# Altium project VlakecDuplo.PrjPCB
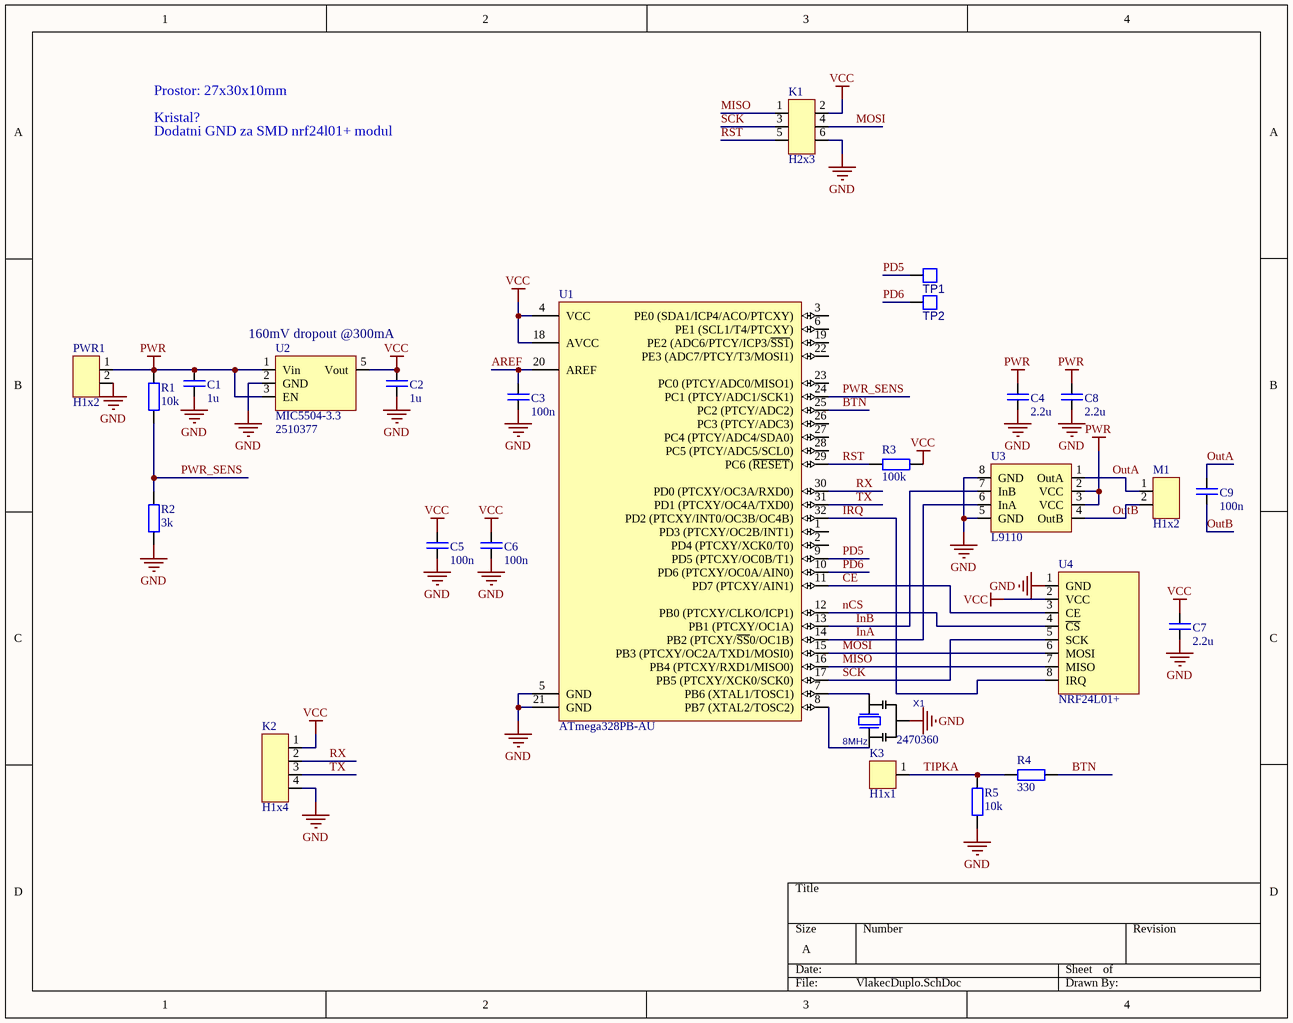
[diagram p0: VlakecDuplo.SchDoc]
1 sheet, 26 parts. Net scope: global (net labels, ports and power ports of the same name join across sheets).
Board file: VlakecDuplo.PcbDoc

## Sheet VlakecDuplo.SchDoc
size A

### Parts
C1  1u  [C0805(2012)_N]
C2  1u  [C0805(2012)_N]
C3  100n  [C0805(2012)_N]
C4  2.2u  [C0805(2012)_N]
C5  100n  [C0805(2012)_N]
C6  100n  [C0805(2012)_N]
C7  2.2u  [C0805(2012)_N]
C8  2.2u  [C0805(2012)_N]
C9  100n  [C0805(2012)_N]
K1  H2x3  [H2X3_SPEEDY]
K2  H1x4  [H1x4]
K3  H1x1  [H1x1]
M1  H1x2  [H1x2]
PWR1  H1x2  [H1x2]
R1  10k  [R0805(2012)_N]
R2  3k  [R0805(2012)_N]
R3  100k  [R0805(2012)_N]
R4  330  [R0805(2012)_N]
R5  10k  [R0805(2012)_N]
TP1  PD5  [PAD_HOLE]  (value not drawn)
TP2  PD6  [PAD_HOLE]  (value not drawn)
U1  ATmega328PB-AU  [32A_N]
U2  MIC5504-3.3  Supplier Part Number 1: 2510377  [SOT23-5]
U3  L9110  [SOP-8]
U4  NRF24L01+  [NRF24L01+smd_module]
X1  8MHz  Supplier Part Number 1: 2470360  [RESONATOR_3213met_L]

### Nets
GND: C1.2 C2.2 C3.2 C4.2 C5.2 C6.2 C7.2 C8.2 K1.6 K2.4 PWR1.2 R2.2 R5.2 U1.5(GND) U1.21(GND) U2.2(GND) U3.5(GND) U3.8(GND) U4.1(GND) X1.2(GND)
PWR: C1.1 C4.1 C8.1 PWR1.1 R1.1 U2.1(Vin) U2.3(EN) U3.2(VCC) U3.3(VCC)
VCC: C2.1 C5.1 C6.1 C7.1 K1.2 K2.1 R3.2 U1.4(VCC) U1.18(AVCC) U2.5(Vout) U4.2(VCC)
AREF: C3.1 U1.20(AREF)
BTN: R4.2 U1.25(PC2_(PTCY/ADC2))
CE: U1.11(PD7_(PTCXY/AIN1)) U4.3(CE)
InA: U1.14(PB2_(PTCXY/~{SS}0/OC1B)) U3.6(InA)
InB: U1.13(PB1_(PTCXY/OC1A)) U3.7(InB)
IRQ: U1.32(PD2_(PTCXY/INT0/OC3B/OC4B)) U4.8(IRQ)
MISO: K1.1 U1.16(PB4_(PTCXY/RXD1/MISO0)) U4.7(MISO)
MOSI: K1.4 U1.15(PB3_(PTCXY/OC2A/TXD1/MOSI0)) U4.6(MOSI)
nCS: U1.12(PB0_(PTCXY/CLKO/ICP1)) U4.4(~{CS})
OutA: C9.1 M1.1 U3.1(OutA)
OutB: C9.2 M1.2 U3.4(OutB)
PD5: TP1.1 U1.9(PD5_(PTCXY/OC0B/T1))
PD6: TP2.1 U1.10(PD6_(PTCXY/OC0A/AIN0))
PWR_SENS: R1.2 R2.1 U1.24(PC1_(PTCY/ADC1/SCK1))
RST: K1.5 R3.1 U1.29(PC6_(~{RESET}))
RX: K2.2 U1.30(PD0_(PTCXY/OC3A/RXD0))
SCK: K1.3 U1.17(PB5_(PTCXY/XCK0/SCK0)) U4.5(SCK)
TIPKA: K3.1 R4.1 R5.1
TX: K2.3 U1.31(PD1_(PTCXY/OC4A/TXD0))
NetU1_7: U1.7(PB6_(XTAL1/TOSC1)) X1.3
NetU1_8: U1.8(PB7_(XTAL2/TOSC2)) X1.1

Not connected (* = marked no-connect by the designer): U1 1(PD3_(PTCXY/OC2B/INT1)) 2(PD4_(PTCXY/XCK0/T0)) 3(PE0_(SDA1/ICP4/ACO/PTCXY)) 6(PE1_(SCL1/T4/PTCXY)) 19(PE2_(ADC6/PTCY/ICP3/~{SS1})) 22(PE3_(ADC7/PTCY/T3/MOSI1)) 23(PC0_(PTCY/ADC0/MISO1)) 26(PC3_(PTCY/ADC3)) 27(PC4_(PTCY/ADC4/SDA0)) 28(PC5_(PTCY/ADC5/SCL0))

### Notes on the sheet
- Prostor: 27x30x10mm
- Kristal?
- Dodatni GND za SMD nrf24l01+ modul
- 160mV dropout @300mA

### Library data of the parts
C1-C9 = C: Capacitor
K1 = H2x3: Header 2x3 (male)
K2 = H1x4: Header 1x4 (male)
K3 = H1x1: Header 1x1 (male)
M1 PWR1 = H1x2: Header 1x2 (male)
R1-R5 = R
TP1 TP2 = PAD
U1 = ATmega328PB-AU: 8-bit AVR Microcontroller, 32KB Flash, 1KB EEPROM, 2KB SRAM, 32-pin TQFP, Industrial Grade (-40°C to 85°C); DatasheetVersion: revC, Oct-2015; PackageReference: 32A; PackageDescription: 32-Lead, 7x7x1.0 mm Body, 0.8mm Lead Pitch, Thin Profile Plastic Quad Flat Package (TQFP); Code_JEDEC: MS-026-ABA; ComponentLink1Description: Manufacturer URL; ComponentLink1URL: http://www.atmel.com/; ComponentLink2Description: ATmega328PB Datasheet; ComponentLink2URL: http://www.atmel.com/Images/Atmel-42397-8-bit-AVR-Microcontroller-ATmega328PB_Datasheet.pdf; ComponentLink3Description: ATmega328P Summary; ComponentLink3URL: http://www.atmel.com/Images/Atmel-42397-8-bit-AVR-Microcontroller-ATmega328PB_Summary.pdf
X1 = ResonatorWCaps: Crystal; Supplier 1: Farnell
U2 = MIC5504-3.3: Supplier 1: Farnell